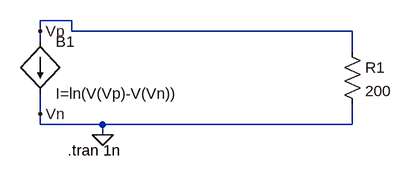
[diagram p0: schematic Draft2.asc]
Draft2.asc, the LTspice schematic file:
Version 4
SHEET 1 880 680
WIRE 144 64 96 64
WIRE 96 80 96 64
WIRE 144 80 144 64
WIRE 576 80 144 80
WIRE 96 96 96 80
WIRE 576 112 576 80
WIRE 96 208 96 176
WIRE 96 224 96 208
WIRE 192 224 96 224
WIRE 576 224 576 192
WIRE 576 224 192 224
WIRE 192 240 192 224
FLAG 192 240 0
FLAG 96 80 Vp
FLAG 96 208 Vn
SYMBOL res 560 96 R0
SYMATTR InstName R1
SYMATTR Value 200
SYMBOL bi 96 96 R0
SYMATTR InstName B1
SYMATTR Value I=ln(V(Vp)-V(Vn))
TEXT 138 264 Left 2 !.tran 1n

The netlist it stands for:
* Draft2.asc
R1 Vp 0 200
B1 Vp 0 I=ln(V(Vp)-V(Vn))
.tran 1n
.backanno
.end